# Altium project GRAVITAS_CCU_HAS.PrjPcb (part 2 of 2)
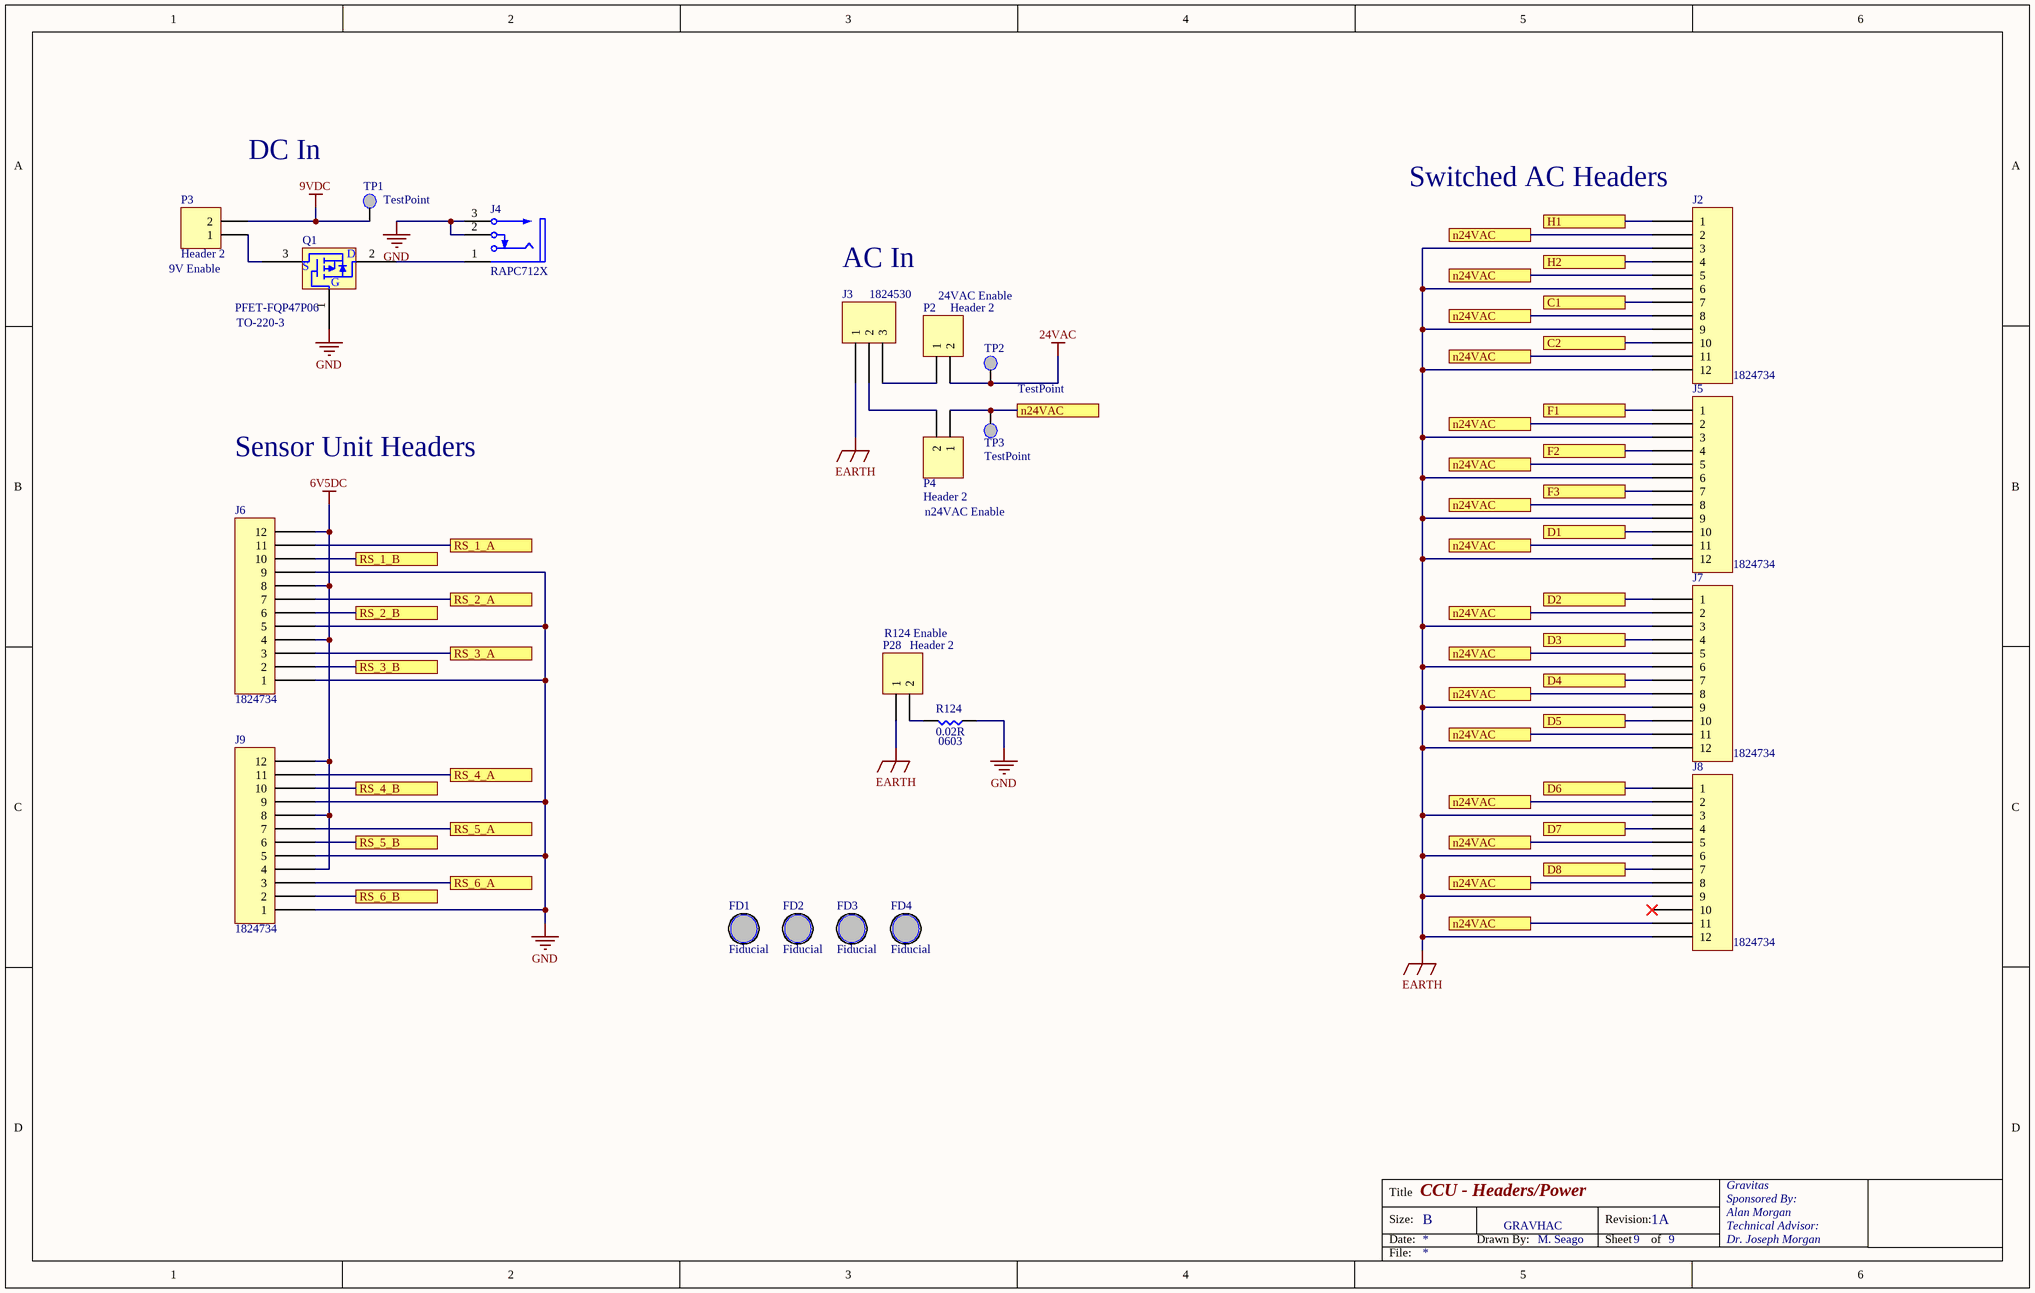
[diagram p9: HEADERS_HAS_CCU.SchDoc]

## Nets that join several sheets
3V3DC: MCU_SUPPORT_CCU_HAS (29 pins), VREG_CCU_HAS (16 pins), UI_CCU_HAS (20 pins), USB_BREAKOUTS_CCU_HAS (7 pins), ETH_ICD_CCU_HAS (6 pins), CTL_RELAY_SHEET1_CCU_HAS (21 pins), CTL_RELAY_SHEET2_CCU_HAS (24 pins)
5VDC: VREG_CCU_HAS (17 pins), UI_CCU_HAS (C72.2 C73.2 P12.4 P14.2), USB_BREAKOUTS_CCU_HAS (R111.2 U10.5), RS485_CCU_HAS (36 pins)
6V5DC: VREG_CCU_HAS (8 pins), HEADERS_HAS_CCU (6 pins)
9VDC: VREG_CCU_HAS (9 pins), HEADERS_HAS_CCU (P3.2 TP1.1)
24VAC: CTL_RELAY_SHEET1_CCU_HAS (7 pins), CTL_RELAY_SHEET2_CCU_HAS (8 pins), HEADERS_HAS_CCU (P2.2 TP2.1)
GND: MCU_SUPPORT_CCU_HAS (28 pins), VREG_CCU_HAS (44 pins), UI_CCU_HAS (24 pins), USB_BREAKOUTS_CCU_HAS (13 pins), ETH_ICD_CCU_HAS (15 pins), RS485_CCU_HAS (18 pins), CTL_RELAY_SHEET1_CCU_HAS (21 pins), CTL_RELAY_SHEET2_CCU_HAS (24 pins), HEADERS_HAS_CCU (10 pins)
NetF1_2: CTL_RELAY_SHEET1_CCU_HAS (F1.2), HEADERS_HAS_CCU (J2.1)
NetF2_2: CTL_RELAY_SHEET1_CCU_HAS (F2.2), HEADERS_HAS_CCU (J2.4)
NetF3_2: CTL_RELAY_SHEET1_CCU_HAS (F3.2), HEADERS_HAS_CCU (J2.7)
NetF4_2: CTL_RELAY_SHEET1_CCU_HAS (F4.2), HEADERS_HAS_CCU (J2.10)
NetF5_2: CTL_RELAY_SHEET1_CCU_HAS (F5.2), HEADERS_HAS_CCU (J5.1)
NetF6_2: CTL_RELAY_SHEET1_CCU_HAS (F6.2), HEADERS_HAS_CCU (J5.4)
NetF7_2: CTL_RELAY_SHEET1_CCU_HAS (F7.2), HEADERS_HAS_CCU (J5.7)
NetF8_2: CTL_RELAY_SHEET2_CCU_HAS (F8.2), HEADERS_HAS_CCU (J5.10)
NetF9_2: CTL_RELAY_SHEET2_CCU_HAS (F9.2), HEADERS_HAS_CCU (J7.1)
NetF10_2: CTL_RELAY_SHEET2_CCU_HAS (F10.2), HEADERS_HAS_CCU (J7.4)
NetF11_2: CTL_RELAY_SHEET2_CCU_HAS (F11.2), HEADERS_HAS_CCU (J7.7)
NetF12_2: CTL_RELAY_SHEET2_CCU_HAS (F12.2), HEADERS_HAS_CCU (J7.10)
NetF13_2: CTL_RELAY_SHEET2_CCU_HAS (F13.2), HEADERS_HAS_CCU (J8.1)
NetF14_2: CTL_RELAY_SHEET2_CCU_HAS (F14.2), HEADERS_HAS_CCU (J8.4)
NetF15_2: CTL_RELAY_SHEET2_CCU_HAS (F15.2), HEADERS_HAS_CCU (J8.7)
NetJ6_2: RS485_CCU_HAS (R69.2 R79.2 U5.7), HEADERS_HAS_CCU (J6.2)
NetJ6_3: RS485_CCU_HAS (P7.2 R71.1 U5.6), HEADERS_HAS_CCU (J6.3)
NetJ6_6: RS485_CCU_HAS (R58.2 R68.2 U4.7), HEADERS_HAS_CCU (J6.6)
NetJ6_7: RS485_CCU_HAS (P6.2 R63.1 U4.6), HEADERS_HAS_CCU (J6.7)
NetJ6_10: RS485_CCU_HAS (R57.2 R67.2 U3.7), HEADERS_HAS_CCU (J6.10)
NetJ6_11: RS485_CCU_HAS (P5.2 R59.1 U3.6), HEADERS_HAS_CCU (J6.11)
NetJ9_2: RS485_CCU_HAS (R82.2 R92.2 U8.7), HEADERS_HAS_CCU (J9.2)
NetJ9_3: RS485_CCU_HAS (P10.2 R87.1 U8.6), HEADERS_HAS_CCU (J9.3)
NetJ9_6: RS485_CCU_HAS (R81.2 R91.2 U7.7), HEADERS_HAS_CCU (J9.6)
NetJ9_7: RS485_CCU_HAS (P9.2 R83.1 U7.6), HEADERS_HAS_CCU (J9.7)
NetJ9_10: RS485_CCU_HAS (R70.2 R80.2 U6.7), HEADERS_HAS_CCU (J9.10)
NetJ9_11: RS485_CCU_HAS (P8.2 R75.1 U6.6), HEADERS_HAS_CCU (J9.11)
NetP15_1: USB_BREAKOUTS_CCU_HAS (P15.1), RS485_CCU_HAS (R61.1 U1.69 U3.4)
NetP15_2: USB_BREAKOUTS_CCU_HAS (P15.2), RS485_CCU_HAS (R60.1 U1.70 U3.1)
NetP15_3: USB_BREAKOUTS_CCU_HAS (P15.3), RS485_CCU_HAS (R62.1 U1.68 U3.2 U3.3)
NetP16_1: USB_BREAKOUTS_CCU_HAS (P16.1), RS485_CCU_HAS (R65.1 U1.12 U4.4)
NetP16_2: USB_BREAKOUTS_CCU_HAS (P16.2), RS485_CCU_HAS (R64.1 U1.11 U4.1)
NetP16_3: USB_BREAKOUTS_CCU_HAS (P16.3), RS485_CCU_HAS (R66.1 U1.9 U4.2 U4.3)
NetP17_1: USB_BREAKOUTS_CCU_HAS (P17.1), RS485_CCU_HAS (R73.1 U1.13 U5.4)
NetP17_2: USB_BREAKOUTS_CCU_HAS (P17.2), RS485_CCU_HAS (R72.1 U1.16 U5.1)
NetP17_3: USB_BREAKOUTS_CCU_HAS (P17.3), RS485_CCU_HAS (R74.1 U1.10 U5.2 U5.3)
NetP19_1: USB_BREAKOUTS_CCU_HAS (P19.1), RS485_CCU_HAS (R77.1 U1.23 U6.4)
NetP19_2: USB_BREAKOUTS_CCU_HAS (P19.2), RS485_CCU_HAS (R76.1 U1.24 U6.1)
NetP19_3: USB_BREAKOUTS_CCU_HAS (P19.3), RS485_CCU_HAS (R78.1 U1.22 U6.2 U6.3)
NetP20_1: USB_BREAKOUTS_CCU_HAS (P20.1), RS485_CCU_HAS (R85.1 U1.48 U7.4)
NetP20_2: USB_BREAKOUTS_CCU_HAS (P20.2), RS485_CCU_HAS (R84.1 U1.31 U7.1)
NetP20_3: USB_BREAKOUTS_CCU_HAS (P20.3), RS485_CCU_HAS (R86.1 U1.30 U7.2 U7.3)
NetP21_1: USB_BREAKOUTS_CCU_HAS (P21.1), RS485_CCU_HAS (R89.1 U1.34 U8.4)
NetP21_2: USB_BREAKOUTS_CCU_HAS (P21.2), RS485_CCU_HAS (R88.1 U1.36 U8.1)
NetP21_3: USB_BREAKOUTS_CCU_HAS (P21.3), RS485_CCU_HAS (R90.1 U1.35 U8.2 U8.3)
NetP22_1: UI_CCU_HAS (SD1.5 U1.109), USB_BREAKOUTS_CCU_HAS (P22.1)
NetP22_2: UI_CCU_HAS (SD1.3 U1.111), USB_BREAKOUTS_CCU_HAS (P22.2)
NetP22_3: UI_CCU_HAS (R95.1 U1.106), USB_BREAKOUTS_CCU_HAS (P22.3)
NetQ14_1: CTL_RELAY_SHEET1_CCU_HAS (U1.128), CTL_RELAY_SHEET2_CCU_HAS (Q14.1 R26.2)
NetQ15_1: CTL_RELAY_SHEET1_CCU_HAS (U1.127), CTL_RELAY_SHEET2_CCU_HAS (Q15.1 R27.2)
NetQ16_1: CTL_RELAY_SHEET1_CCU_HAS (U1.126), CTL_RELAY_SHEET2_CCU_HAS (Q16.1 R32.2)
NetQ17_1: CTL_RELAY_SHEET1_CCU_HAS (U1.125), CTL_RELAY_SHEET2_CCU_HAS (Q17.1 R33.2)
NetQ18_1: CTL_RELAY_SHEET1_CCU_HAS (U1.124), CTL_RELAY_SHEET2_CCU_HAS (Q18.1 R38.2)
NetQ19_1: CTL_RELAY_SHEET1_CCU_HAS (U1.117), CTL_RELAY_SHEET2_CCU_HAS (Q19.1 R39.2)
NetQ20_1: CTL_RELAY_SHEET1_CCU_HAS (U1.116), CTL_RELAY_SHEET2_CCU_HAS (Q20.1 R44.2)
NetQ21_1: CTL_RELAY_SHEET1_CCU_HAS (U1.113), CTL_RELAY_SHEET2_CCU_HAS (Q21.1 R45.2)